# Altium schematic sheet SchematicTensometr.SchDoc: Tensometer
size 292 x 193 mm; Author: Mikołaj Roszczyk; CompanyName: Politechnika Warszawska; Organization: WEITI; Revision: 5; SheetNumber: 4; SheetTotal: 5; Group_Name: Under Pressure; ProjName: Sweet Dreams
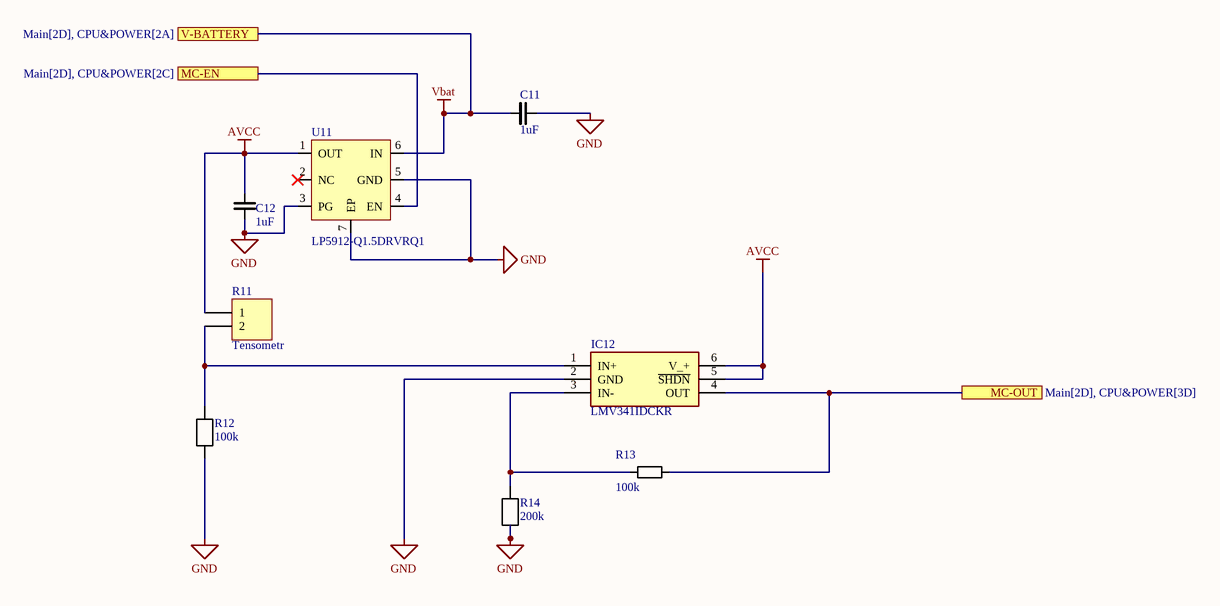
[diagram p0: SchematicTensometr.SchDoc]

## Parts
C11  1uF  [0402_CAP]
C12  1uF  [0402_CAP]
IC12  LMV341IDCKR  [SOT65P210X110-6N_m]
R11  Tensometr  [HDR1X2]
R12  100k  [0402_RES]
R13  100k  [0402_RES]
R14  200k  [0402_RES]
U11  LP5912-Q1.5DRVRQ1  [SON65P200X200X80-7N_m]

## Ports
MC-EN (see Main[2D], CPU&POWER[2C]), MC-OUT (see Main[2D], CPU&POWER[3D]), V-BATTERY (see Main[2D], CPU&POWER[2A])

## Nets
AVCC: C12.2 IC12.5(~{SHDN}) IC12.6(V_+) R11.1 U11.1(OUT)
GND: C11.1 C12.1 IC12.2(GND) R12.2 R14.2 U11.3(PG) U11.5(GND) U11.7(EP)
Vbat: C11.2 U11.6(IN) ; port V-BATTERY
MC-EN: U11.4(EN) ; port MC-EN
MC-OUT: IC12.4(OUT) R13.2 ; port MC-OUT
NetIC12_1: IC12.1(IN+) R11.2 R12.1
NetIC12_3: IC12.3(IN-) R13.1 R14.1

Not connected (* = marked no-connect by the designer): U11 2(NC)*

## Notes on the sheet
- Data:
- Tytuł:
- Rev.:
- Rozm.:
- A4
- Strona:
- z
- PBL4
- Opracował:

## Library data of the parts
C11 C12 = Cap: Ceramic capacitor
IC12 = LMV341IDCKR: Integrated Circuit; Manufacturer_Name: Texas Instruments; Datasheet Link: http://www.ti.com/lit/gpn/lmv341; Height: 1.1mm; Manufacturer_Part_Number: LMV341IDCKR; Mouser Part Number: 595-LMV341IDCKR; Mouser Price/Stock: https://www.mouser.co.uk/ProductDetail/Texas-Instruments/LMV341IDCKR/?qs=paYhMW8qfiso3OfEEvyk%2Fg%3D%3D; Arrow Part Number: LMV341IDCKR; Arrow Price/Stock: https://www.arrow.com/en/products/lmv341idckr/texas-instruments
R11 = Header 2: Header, 2-Pin; LatestRevisionDate: 17-Jul-2002; LatestRevisionNote: Re-released for DXP Platform.; Publisher: Altium Limited
R12 R14 = Resistor
R13 = RES: Resistor
U11 = STAB